# Altium schematic sheet Sheet1.SchDoc
size A4
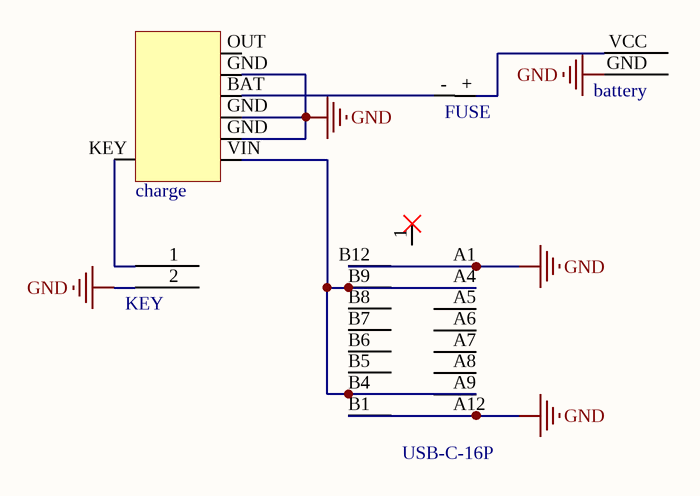
[diagram p0: Sheet1.SchDoc]

## Parts
battery  battery  [battery]
charge  charge  [charge]
FUSE  FUSE  [fuse]
KEY  KEY  [KEY]
USB-C  USB-C-16P  [USB-C]

## Nets
GND: battery.GND charge.GND KEY.2 USB-C.A1 USB-C.A12 USB-C.B1 USB-C.B12
Netbattery_VCC: battery.VCC FUSE.+
Netcharge_BAT: charge.BAT FUSE.-
Netcharge_KEY: charge.KEY KEY.1
Netcharge_VIN: charge.VIN USB-C.A4 USB-C.A9 USB-C.B4 USB-C.B9

Not connected (* = marked no-connect by the designer): charge OUT; USB-C 1* A5 A6 A7 A8 B5 B6 B7 B8